# EAGLE design LilyMini_Protosnap_updated (EAGLE 7.7.0)
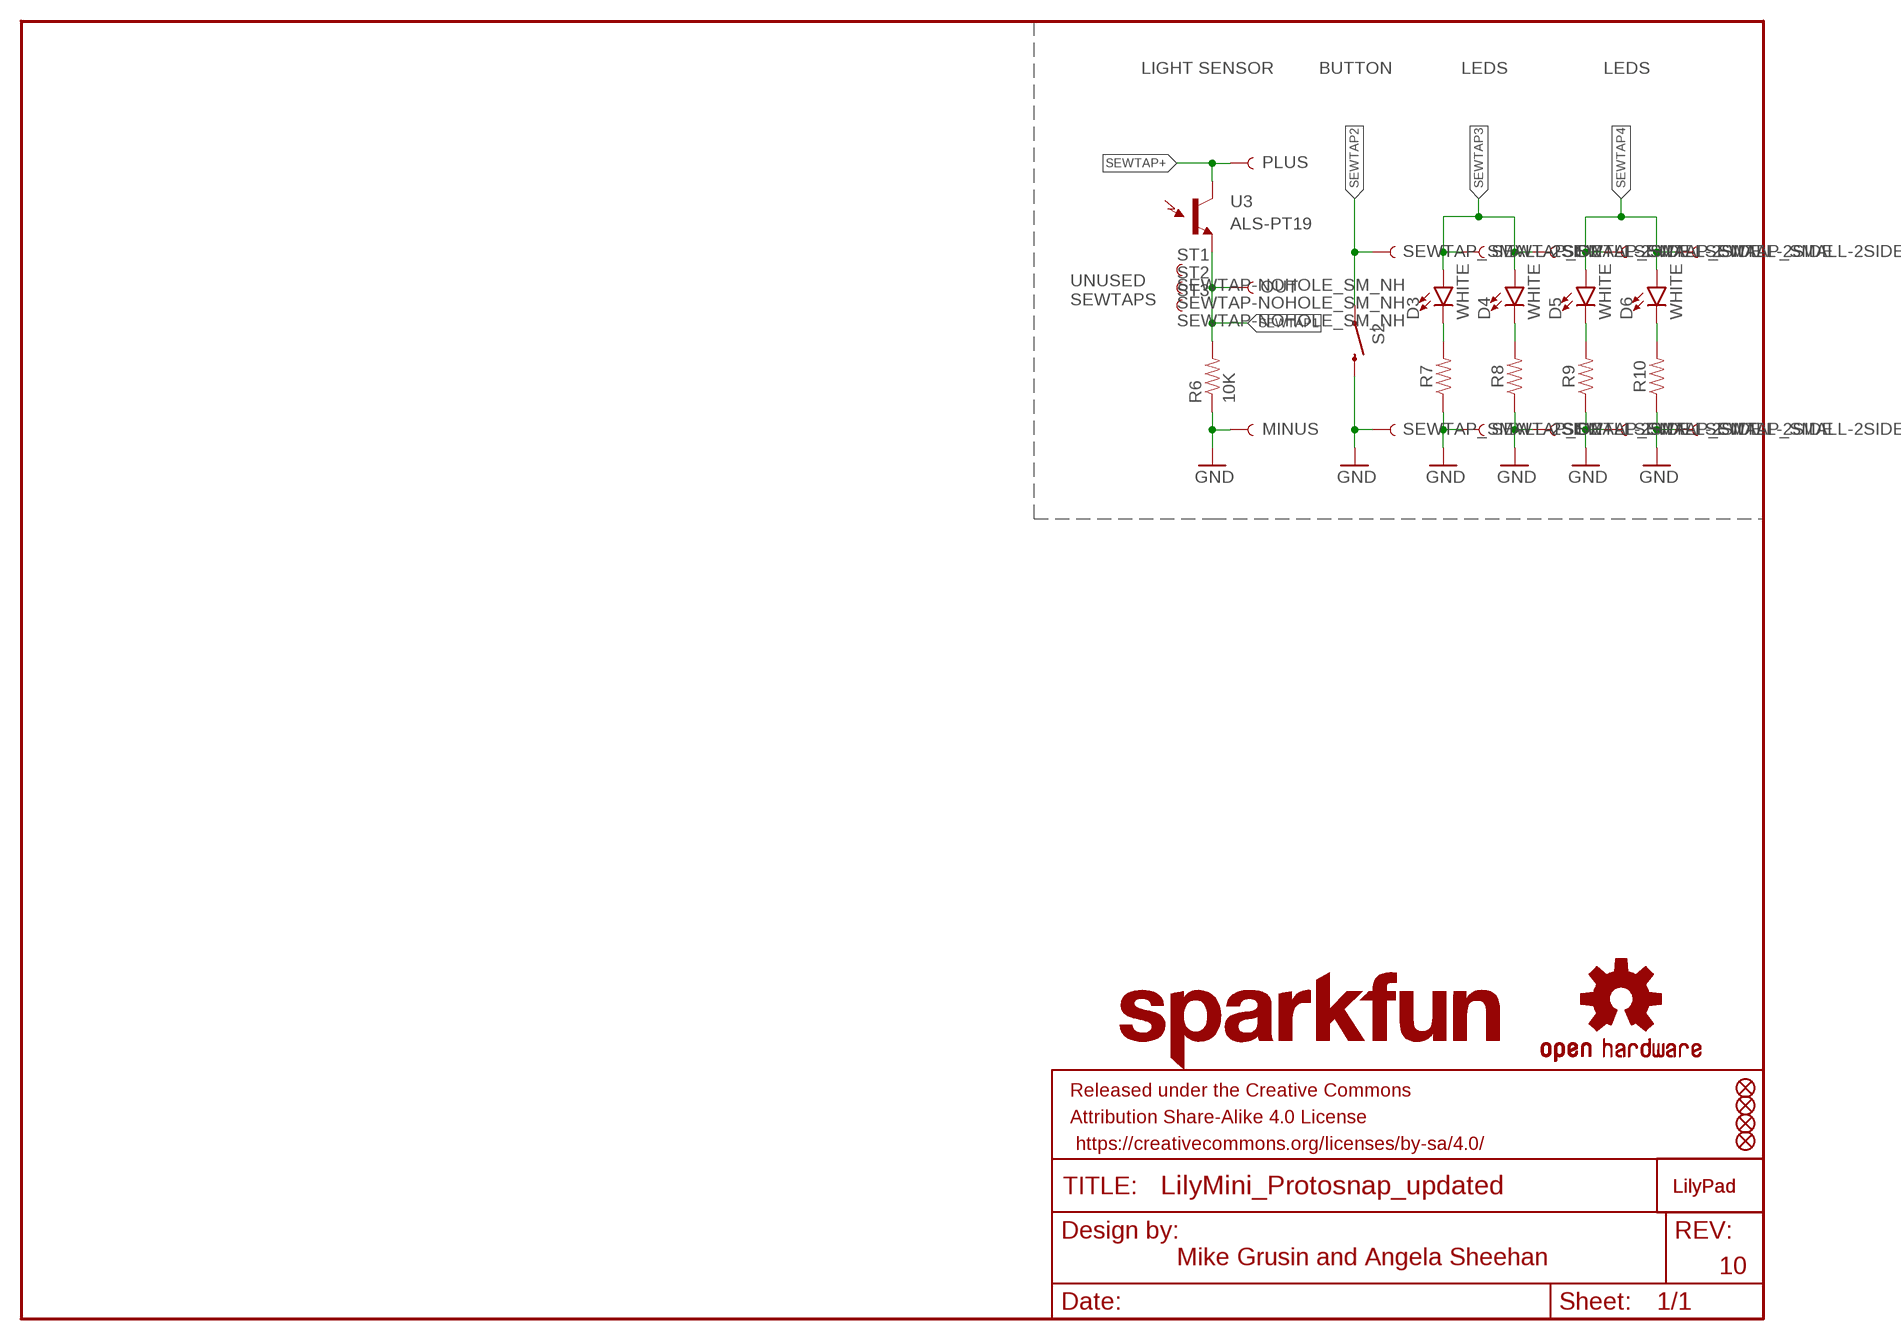
[diagram p0: schematic, sheet 1]

## Parts
$1_61_$_2016-09-25_21-56-09  OSHW-LOGOS  [OSHW-LOGO-S]
D3  WHITE  LED-WHITE1206  [LED-1206]
D4  WHITE  LED-WHITE1206  [LED-1206]
D5  WHITE  LED-WHITE1206  [LED-1206]
D6  WHITE  LED-WHITE1206  [LED-1206]
FD1  FIDUCIAL1X2  [FIDUCIAL-1X2]
FD2  FIDUCIAL1X2  [FIDUCIAL-1X2]
FD3  FIDUCIAL1X2  [FIDUCIAL-1X2]
FD4  FIDUCIAL1X2  [FIDUCIAL-1X2]
FRAME1  FRAME-LETTER  [CREATIVE_COMMONS]
JP12  SEWTAP_SMALL-2SIDE  [PETAL-SMALL-2SIDE]
JP13  SEWTAP_SMALL-2SIDE  [PETAL-SMALL-2SIDE]
JP20  SEWTAP_SMALL-2SIDE  [PETAL-SMALL-2SIDE]
JP21  SEWTAP_SMALL-2SIDE  [PETAL-SMALL-2SIDE]
JP22  SEWTAP_SMALL-2SIDE  [PETAL-SMALL-2SIDE]
JP23  SEWTAP_SMALL-2SIDE  [PETAL-SMALL-2SIDE]
JP24  SEWTAP_SMALL-2SIDE  [PETAL-SMALL-2SIDE]
JP25  SEWTAP_SMALL-2SIDE  [PETAL-SMALL-2SIDE]
JP26  SEWTAP_SMALL-2SIDE  [PETAL-SMALL-2SIDE]
JP27  SEWTAP_SMALL-2SIDE  [PETAL-SMALL-2SIDE]
LOGO1  LOGO-LPL  [LOGO-L]
LOGO2  LILYLOGO-L-TOP  [LOGO-L-TOP]
LOGO4  SFE_LOGO_NAME.1_INCH  [SFE_LOGO_NAME_.1]
R6  10K  10KOHM-1/10W-1%(0603)0603  [0603-RES]
R7  RESISTOR0603  [0603]
R8  RESISTOR0603  [0603]
R9  RESISTOR0603  [0603]
R10  RESISTOR0603  [0603]
S2  SWITCH-MOMENTARY-2SMD-REDUNDANT  [TACTILE-SWITCH-SMD]
SEWTAPLS+  PLUS  SEWTAP_SMALL-2SIDE  [PETAL-SMALL-2SIDE]
SEWTAPLS-  MINUS  SEWTAP_SMALL-2SIDE  [PETAL-SMALL-2SIDE]
SEWTAPLSOUT  OUT  SEWTAP_SMALL-2SIDE  [PETAL-SMALL-2SIDE]
ST1  SEWTAP-NOHOLE_SM_NH  [PETAL-SMALL-NOHOLE]
ST2  SEWTAP-NOHOLE_SM_NH  [PETAL-SMALL-NOHOLE]
ST3  SEWTAP-NOHOLE_SM_NH  [PETAL-SMALL-NOHOLE]
U3  ALS-PT19  LIGHTSENSORALS  [ALS-PT19]

## Nets
GND: JP13.1 JP21.1 JP23.1 JP25.1 JP27.1 R6.1 R7.1 R8.1 R9.1 R10.1 S2.3 S2.4 SEWTAPLS-.1
N$2: D3.C R7.2
N$3: D4.C R8.2
N$4: D5.C R9.2
N$5: D6.C R10.2
SEWTAP1: R6.2 SEWTAPLSOUT.1 U3.E(E1)
SEWTAP2: JP12.1 S2.1 S2.2
SEWTAP3: D3.A D4.A JP20.1 JP22.1
SEWTAP4: D5.A D6.A JP24.1 JP26.1
SEWTAP+: SEWTAPLS+.1 U3.C(C1)

## Notes on the sheet
- LIGHT SENSOR | BUTTON | LEDS | LEDS
- UNUSED
  SEWTAPS
- Mike Grusin and Angela Sheehan
- 10

## Library data of the parts
$1_61_$_2016-09-25_21-56-09 = SparkFun-Aesthetics:OSHW-LOGO: Open-Source Hardware (OSHW) Logo This logo indicates the piece of hardware it is found on incorporates a OSHW license and/or adheres to the definition of open source hardware found here: http://freedomdefined.org/OSHW
D3-D6 = SparkFun-LED:LED-WHITE: White SMD LED Used in manufacturing several products at SparkFun. Packages: 0603 - Bright White SMD 0603 package[Product Link] <http://www.kingbrightusa.com/product.asp?catalog_name=LED&product_id=APT1608QWF/D> 1206 - Bright White SMD1206 package [Product Link] <http://www.kingbrightusa.com/product.asp?catalog_name=LED&product_id=APT3216QWF/D> SparkFun Products: Blackberry Trackballer Breakout <https://www.sparkfun.com/products/13169> Digital SandBox <https://www.sparkfun.com/products/12651>; PROD_ID: DIO-09955
FD1-FD4 = SparkFun-Aesthetics:FIDUCIAL: Fiducial Alignment Points Point-of-reference for pick-and-place machines and other optical instruments.
FRAME1 = SparkFun-Aesthetics:FRAME-LETTER: Schematic Frame - Letter Standard 8.5x11 US Letter frame
JP12 JP13 JP20-JP27 SEWTAPLS+ SEWTAPLS- SEWTAPLSOUT = LilyPad-Wearables:SEWTAP: SparkFun LilyPad Sew Taps Sewable connection points for LilyPad Boards SparkFun Products: LilyPad Arduino 328 Main Board <https://www.sparkfun.com/products/13342> LilyTiny <https://www.sparkfun.com/products/10899> LilyPad Power Supply <https://www.sparkfun.com/products/11259>
LOGO1 = LilyPad-Wearables:LOGO-LP
LOGO2 = mike-temp:LILYLOGO-L-TOP
LOGO4 = SparkFun-Aesthetics:SFE_LOGO_NAME: SparkFun Font Logo This is the SparkFun name logo. The logo on the schematic will always be the same size; the package variant is the height of the flame part of the logo (or the height the flame would be, if it were drawn). Default layer for the logo on the board is tSilk.
R6 = SparkFun-Resistors:10KOHM-1/10W-1%(0603): RES-00824; PROD_ID: RES-00824
R7-R10 = SparkFun-Resistors:RESISTOR: Generic Resistor Package
S2 = SparkFun-Electromechanical:SWITCH-MOMENTARY-2: Various NO switches- pushbuttons, reed, etc; PROD_ID: SWCH-08247
ST1-ST3 = LilyPad-Wearables:SEWTAP-NOHOLE: SparkFun LilyPad Sew Taps without Holes Petals used for PCB aesthetics. No connection points for circuits, and no hole available for sewing. SparkFun Products: LilyPad Vibe Board <https://www.sparkfun.com/products/11008> LilyPad Accelerometer <https://www.sparkfun.com/products/9267> LilyPad Buzzer <https://www.sparkfun.com/products/8463>
U3 = SparkFun-Sensors:LIGHTSENSOR: Ambient Light Sensor Simple light detection sensor. Output varies with light intensity input. Spark Fun Electronics SKU : COM-08348; PROD_ID: IC-11836

## Net classes
1 USB: width 0.305 mm, drill 0.508 mm, clearance 0.195 mm

## Board
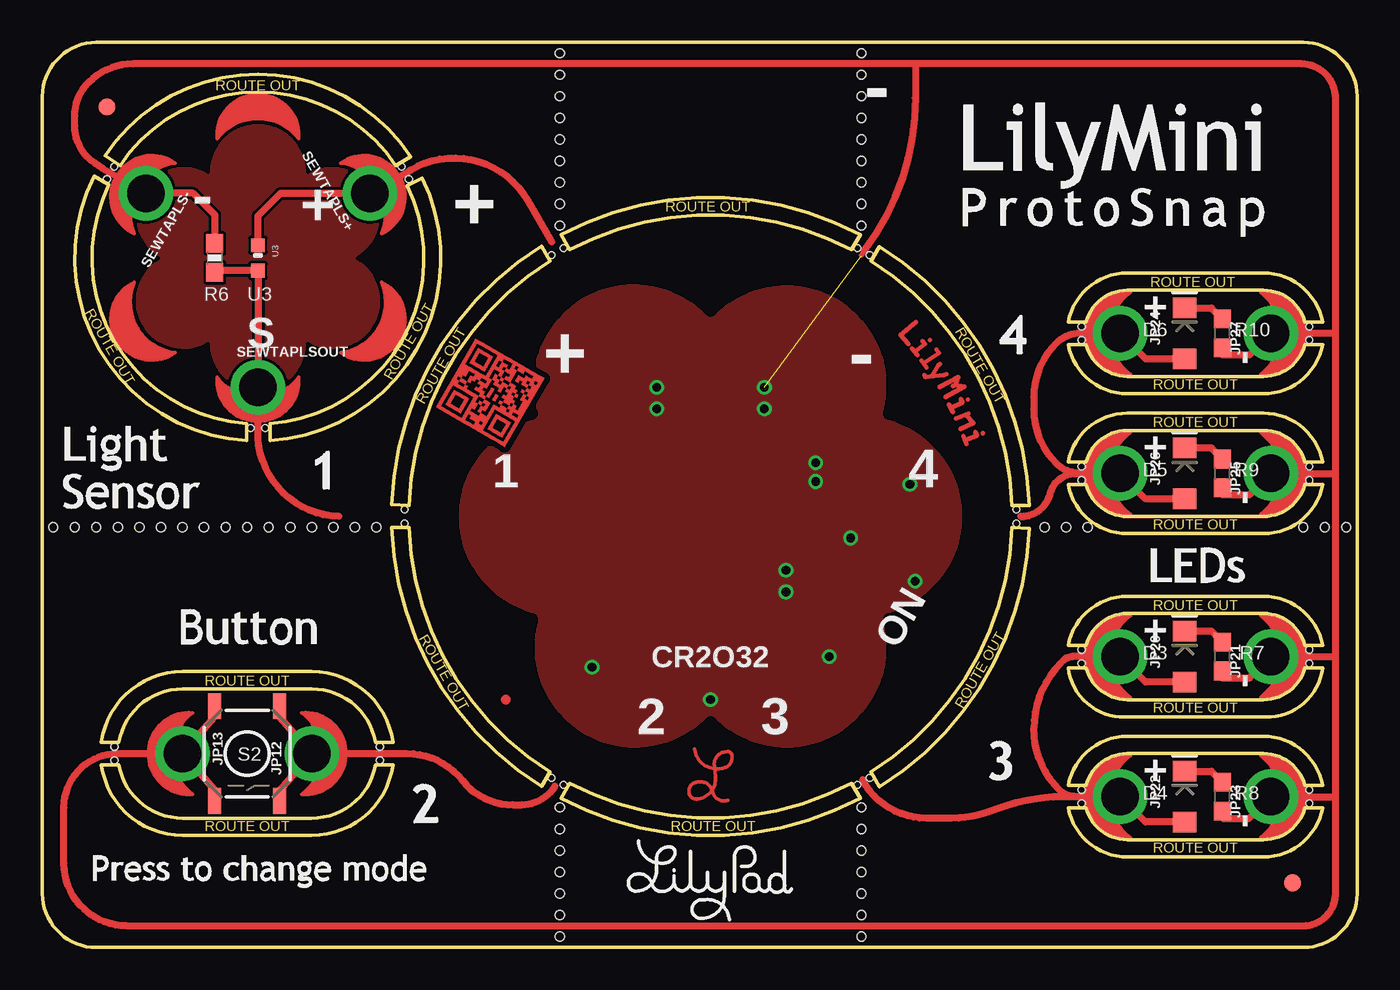
[diagram p1: board, top side]
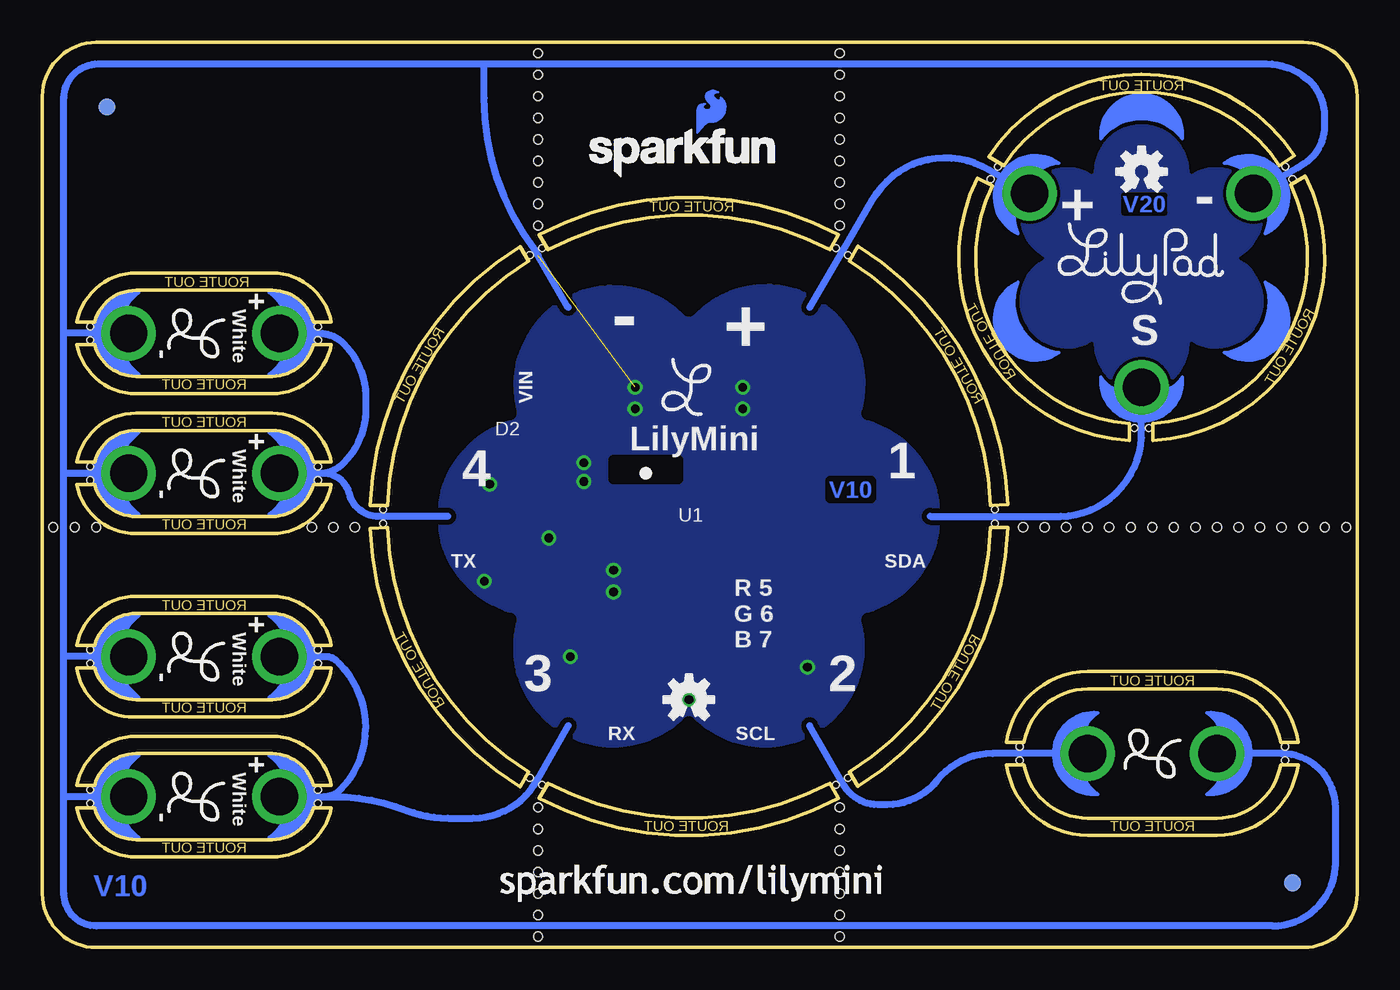
[diagram p2: board, bottom side, seen from below]

Size 77.47 x 53.34 mm. Coordinates in mm from the lower left corner, seen from the top.
Outline: 74.3,0 3.17,0 arc-90 0,3.17 0,50.16 arc-90 3.17,53.34 74.3,53.34 arc-90 77.47,50.16 77.47,3.17 arc-90 74.3,0
Outline: 13.41,30.89 13.41,29.87 arc112 22.38,45.34 21.5,44.9 arc-112 13.41,30.89
Outline: 20.82,46.09 21.7,46.6 arc113 3.7,46.66 4.58,46.09 arc-112 20.82,46.09
Outline: 3.92,44.95 3.04,45.45 arc113 12.04,29.87 12.04,30.88 arc-112 3.92,44.95
Outline: 57.14,26.06 58.15,26.06 arc56 49.33,41.32 48.83,40.46 arc-56 57.14,26.06
Outline: 47.68,41.12 48.19,42 arc56 30.55,42.02 31.06,41.12 arc-56 47.68,41.12
Outline: 29.91,40.46 29.41,41.34 arc56 20.59,26.1 21.6,26.06 arc-56 29.91,40.46
Outline: 21.6,24.74 20.59,24.74 arc56 29.41,9.48 29.91,10.34 arc-56 21.6,24.74
Outline: 31.06,9.68 30.55,8.8 arc56 48.19,8.78 47.68,9.68 arc-56 31.06,9.68
Outline: 48.83,10.34 49.33,9.46 arc56 58.15,24.7 57.14,24.74 arc-56 48.83,10.34
Outline: 4.5,12.09 arc-80 8.26,15.24 15.88,15.24 arc-80 19.63,12.09 20.66,12.09 arc82 15.88,16.26 8.26,16.26 arc82 3.47,12.09 4.5,12.09
Outline: 4.5,10.77 arc80 8.26,7.62 15.88,7.62 arc80 19.63,10.77 20.66,10.77 arc-82 15.88,6.6 8.26,6.6 arc-82 3.47,10.77 4.5,10.77
Outline: 61.49,35.53 arc75 63.94,33.66 71.94,33.66 arc75 74.4,35.53 75.44,35.53 arc-79 71.94,32.64 63.94,32.64 arc-79 60.45,35.53 61.49,35.53
Outline: 61.49,36.85 arc-75 63.94,38.73 71.94,38.73 arc-75 74.4,36.85 75.44,36.85 arc79 71.94,39.75 63.94,39.75 arc79 60.45,36.85 61.49,36.85
Outline: 61.49,27.28 arc75 63.94,25.4 71.94,25.4 arc75 74.4,27.28 75.44,27.28 arc-79 71.94,24.38 63.94,24.38 arc-79 60.45,27.28 61.49,27.28
Outline: 61.49,28.6 arc-75 63.94,30.48 71.94,30.48 arc-75 74.4,28.6 75.44,28.6 arc79 71.94,31.5 63.94,31.5 arc79 60.45,28.6 61.49,28.6
Outline: 61.49,16.48 arc75 63.94,14.61 71.94,14.61 arc75 74.4,16.48 75.44,16.48 arc-79 72.39,13.59 63.5,13.59 arc-79 60.45,16.48 61.49,16.48
Outline: 61.49,17.8 arc-75 63.94,19.68 71.94,19.68 arc-75 74.4,17.8 75.44,17.8 arc79 71.94,20.7 63.94,20.7 arc79 60.45,17.8 61.49,17.8
Outline: 61.49,8.23 arc75 63.94,6.35 71.94,6.35 arc75 74.4,8.23 75.44,8.23 arc-79 71.94,5.33 63.94,5.33 arc-79 60.45,8.23 61.49,8.23
Outline: 61.49,9.55 arc-75 63.94,11.43 71.94,11.43 arc-75 74.4,9.55 75.44,9.55 arc79 71.94,12.45 63.94,12.45 arc79 60.45,9.55 61.49,9.55
Copper layers (1*16): Top 0.035mm / dielectric 1.5mm / Bottom 0.035mm
Design rules "SparkFun-2-layer-TIGHT *": minimum track width 7mil, minimum drill 15mil, track to track 7mil, track to pad 7mil, pad to pad 7mil, via to via 7mil, smd to smd 7mil, copper to edge 7mil, drill to drill 7mil, minimum pad ring 7mil, minimum via ring 7mil, stop-mask expansion 4mil, vias tented up to drill 25mil, thermal gap 10mil
Holes 0.38 mm at 13.12,30.62 12.28,30.62 21.17,46.02 21.59,45.28 3.81,45.28 4.23,46.02 57.4,25.82 57.4,24.98 48.02,41.22 48.74,40.81 30,40.81 30.72,41.22 21.34,24.98 21.34,25.82 30.72,9.58 30,9.99 48.74,9.99 48.02,9.58 4.25,11.02 4.25,11.84 19.88,11.02 19.88,11.84 61.24,35.79 61.24,36.6 74.65,35.79 74.65,36.6 61.24,27.53 61.24,28.35 74.65,27.53 74.65,28.35 61.24,16.74 61.24,17.55 74.65,16.74 74.65,17.55 61.24,8.48 61.24,9.3 74.65,8.48 74.65,9.3
Holes 0.51 mm at 19.68,24.77 18.41,24.77 17.14,24.77 15.88,24.77 14.61,24.77 13.34,24.77 12.06,24.77 10.79,24.77 9.53,24.77 8.26,24.77 6.99,24.77 5.71,24.77 4.45,24.77 3.17,24.77 1.91,24.77 0.64,24.77 59.05,24.77 60.33,24.77 61.59,24.77 74.3,24.77 75.56,24.77 76.83,24.77 30.48,8.26 30.48,6.99 30.48,5.71 30.48,4.45 30.48,3.17 30.48,1.91 30.48,0.64 48.26,8.26 48.26,6.99 48.26,5.71 48.26,4.45 48.26,3.17 48.26,1.91 48.26,0.64 30.48,42.55 30.48,43.81 30.48,45.09 30.48,46.35 30.48,47.62 30.48,48.9 30.48,50.16 30.48,51.44 30.48,52.7 48.26,42.55 48.26,43.81 48.26,45.09 48.26,46.35 48.26,47.62 48.26,48.9 48.26,50.16 48.26,51.44 48.26,52.7
tRestrict: area 21,16.1 to 28.8,34.7; area 23.2,6.8 to 39.4,19.3; area 39.4,6.8 to 55.6,19.3; area 49.9,16.1 to 57.8,34.7; area 23.4,29.6 to 29.5,35.7; area 7.4,30.5 to 18,35.6; area 15.6,31.5 to 23,40.6; area 15.6,40.6 to 23,49.8; area 7.4,45.7 to 17.7,50.8; area 2,40.6 to 9.8,49.8; area 2,31.5 to 9.8,40.6; area 39.4,31.5 to 55.6,44; area 23.2,31.6 to 39.4,44
bRestrict: area 49.9,16.1 to 57.8,34.7; area 39.4,6.8 to 55.6,19.3; area 23.2,6.8 to 39.4,19.3; area 21,16.1 to 28.8,34.7; area 40,27.6 to 43.8,28.7; area 7.4,30.5 to 18,35.6; area 15.6,31.5 to 23,40.6; area 15.6,40.6 to 23,49.8; area 7.4,45.7 to 17.7,50.8; area 2,40.6 to 9.8,49.8; area 2,31.5 to 9.8,40.6; area 39.4,31.5 to 55.6,44; area 23.2,31.6 to 39.3,44.1

### Footprints (pad centres in the part's own frame; a part is rotated, then mirrored left to right if it is on the bottom)
LED-1206 = smd 1.2 x 1.4: A -1.5,0; C 1.5,0
FIDUCIAL-1X2 = smd 1 x 1: 1 0,0
PETAL-SMALL-2SIDE = drill 2.2: 1 0,0
0603-RES = smd 1.1 x 1: 1 -0.85,0; 2 0.85,0
0603 = smd 1.1 x 1: 1 -0.85,0; 2 0.85,0
TACTILE-SWITCH-SMD = smd 1.524 x 0.762: 1 -2.794,1.905; 2 2.794,1.905; 3 -2.794,-1.905; 4 2.794,-1.905
ALS-PT19 = smd 0.8 x 0.8: C -0.75,0; E 0.75,0

### Placement (x,y rotation side)
$1_61_$_2016-09-25_21-56-09  39.37,14.61 0 bottom
D3  67.31,17.14 90 top
D4  67.31,8.89 90 top
D5  67.31,27.94 90 top
D6  67.31,36.2 90 top
FD1  3.81,49.53 0 top
FD2  73.66,3.81 0 top
FD3  73.66,49.53 0 bottom
FD4  3.81,3.81 0 bottom
FRAME1  4.45,-17.78 0 top  (outside the outline)
JP12  15.88,11.43 90 top
JP13  8.26,11.43 270 top
JP20  63.5,17.14 270 top
JP21  72.39,17.14 90 top
JP22  63.5,8.89 270 top
JP23  72.39,8.89 90 top
JP24  63.5,36.2 270 top
JP25  72.39,27.94 90 top
JP26  63.5,27.94 270 top
JP27  72.39,36.2 90 top
LOGO1  39.53,33.02 0 bottom
LOGO2  39.37,10.16 6 top
LOGO3  OSHW-LOGOS  [OSHW-LOGO-S@1]  12.7,45.72 0 bottom
LOGO4  45.72,44.93 0 bottom
R6  10.16,40.64 270 top
R7  69.53,17.14 90 top
R8  69.53,8.89 90 top
R9  69.53,27.94 90 top
R10  69.53,36.2 90 top
S2  12.06,11.43 270 top
SEWTAPLS+  19.3,44.45 120 top
SEWTAPLS-  6.1,44.45 240 top
SEWTAPLSOUT  12.7,33.02 0 top
ST1  12.7,48.26 180 top
ST2  6.1,36.83 300 top
ST3  19.3,36.83 60 top
U3  12.7,40.64 270 top
U$1  [LOGO-LILYPAD]  39.37,4.29 0 top
U$2  LOGO-LPLP  [LOGO-LILYPAD]  12.7,40.64 0 bottom
U$4  [SFE_LOGO_FLAME_COPPER_EXPOSED_.1]  39.21,47.62 0 bottom
U$5  [LOGO-L]  12.06,11.43 270 bottom
U$6  [LOGO-L]  68.42,27.94 270 bottom
U$7  [LOGO-L]  68.42,17.14 270 bottom
U$8  [LOGO-L]  68.42,8.89 270 bottom
U$9  [LOGO-L]  68.42,36.2 270 bottom

### Tracks (layer width: path | path; a pad name or v marks a point on that pad's centre or on a via)
GND  (via drill 0.51)  (1 unrouted)
  Top 0.305: 48.26,40.77 48.44,41.09
  Top 0.406: 76.2,8.89 76.2,3.17 arc-90 74.3,1.27 4.97,1.27 arc-90 1.27,4.97 1.27,8.26 arc-90 4.45,11.43 JP13.1 | 76.2,8.89 76.2,17.14 | 76.2,17.14 76.2,27.94 | 76.2,27.94 76.2,36.2 | 76.2,36.2 76.2,50.06 arc90 74.19,52.07 51.44,52.07 | 51.44,52.07 5.34,52.07 arc45 2.73,50.99 arc45 1.91,49.01 1.91,48.42 arc57 3.1,46.22 3.54,45.94 SEWTAPLS-.1 8.89,44.45 10.16,43.18 R6.1 | R7.1 69.53,15.88 71.12,15.88 JP21.1 76.2,17.14 | R8.1 69.53,7.62 71.12,7.62 JP23.1 76.2,8.89 | 76.2,36.2 JP27.1 71.12,34.92 69.53,34.92 R10.1 | 76.2,27.94 JP25.1 71.12,26.67 69.53,26.67 R9.1 | S2.3 10.16,13.59 JP13.1 | S2.4 10.16,9.27 JP13.1 | 51.44,52.07 51.44,50.08 arc-37 48.44,41.09
  other vias: 42.55,31.75 51.12,27.3 45.56,28.57 45.56,27.46 43.81,20.95 39.37,14.61 36.2,31.75 46.35,17.14 51.44,21.59 47.62,24.13 32.38,16.51 42.55,33.02 36.2,33.02 43.81,22.23
  pour Top (isolate 0.305): 39.37,43.97 30.16,41.27 23.18,34.71 20.95,25.4 23.18,16.09 30.16,9.53 39.37,6.77 48.58,9.53 55.56,16.09 57.78,25.4 55.56,34.71 48.58,41.27
  pour Bottom (isolate 0.305): 39.37,43.97 48.58,41.27 55.56,34.71 57.78,25.4 55.56,16.09 48.58,9.53 39.37,6.77 30.16,9.53 23.18,16.09 20.95,25.4 23.18,34.77 30.16,41.27
GND4
  Bottom 0.406: 76.2,8.89 76.2,3.17 arc-90 74.3,1.27 4.97,1.27 arc-90 1.27,4.97 1.27,8.26 arc-90 4.45,11.43 8,11.43 | 76.2,8.89 76.2,17.14 | 76.2,17.14 76.2,27.94 | 76.2,27.94 76.2,36.2 | 76.2,36.2 76.2,50.06 arc90 74.19,52.07 51.44,52.07 | 51.44,52.07 5.34,52.07 arc45 2.73,50.99 arc45 1.91,49.01 1.91,48.42 arc57 3.1,46.22 3.54,45.94 6.1,44.45 | 72.39,36.2 76.2,36.2 | 72.39,27.94 76.2,27.94 | 72.39,17.14 76.2,17.14 | 72.39,8.89 76.2,8.89 | 46.48,37.72 48.26,40.77 48.44,41.09 arc37 51.44,50.08 51.44,52.07
N$2
  Top 0.406: D3.C 68.88,18.64 R7.2
N$3
  Top 0.406: D4.C 68.88,10.39 R8.2
N$4
  Top 0.406: R9.2 68.88,29.44 D5.C
N$5
  Top 0.406: D6.C 68.88,37.7 R10.2
N$6
  pour Top: 7.37,31.5 12.7,30.48 18.03,31.5 21.59,35.24 23.04,40.64 21.59,45.72 17.71,49.78 12.7,50.8 7.37,49.78 3.81,45.72 2.04,40.64 3.81,35.56
N$7
  pour Bottom: 7.37,31.5 12.7,30.48 18.03,31.5 21.59,35.24 23.04,40.64 21.59,45.72 17.71,49.78 12.7,50.8 7.37,49.78 3.81,45.72 2.04,40.64 3.81,35.56
N$8
  Top 0.254: 54.28,30.14 54.45,29.66
N$9
  Top 0.254: 54.41,29.92 55.07,30.16 54.99,30.39
N$10
  Top 0.254: 55.42,30.3
N$11
  Top 0.254: 54.11,30.57 54.85,30.89 54.43,31.36
N$12
  Top 0.254: 53.84,31.16 54.56,31.46
N$13
  Top 0.254: 53.65,31.55 53.43,32
N$14
  Top 0.254: 53.59,31.81 54.22,32.11 54.12,32.32
N$15
  Top 0.254: 54.55,32.28
N$16
  Top 0.254: 53.21,32.44 54.32,33.05 53.76,33.14 53.65,33.08 53.79,33.16 53.98,33.62 52.86,33.02
N$17
  Top 0.254: 51.98,33.75 52.04,33.62 53.11,33.72 53.27,33.8
N$18
  Top 0.254: 52.88,34.38 52.79,34.32 52.42,33.68
N$19
  Top 0.254: 51.8,34.59 52.08,34.19
N$20
  Top 0.254: 51.96,34.43 52.83,35.03 52.69,35.23
N$21
  Top 0.254: 51.25,35.29 51.55,34.9
N$22
  Top 0.254: 51.42,35.12 52.01,35.55 51.86,35.75
N$23
  Top 0.254: 52.3,35.8 52.3,35.79
N$24
  Top 0.254: 51.03,35.57 50.57,36.08 51.46,36.84
SEWTAP1
  Top 0.406: R6.2 10.16,39.89 U3.E SEWTAPLSOUT.1 12.7,30.48 arc90 17.46,25.4
SEWTAP2
  Top 0.406: JP12.1 21.48,11.43 arc-52 24.75,9.85 arc52 27.7,8.41 28.25,8.41 arc58 30.2,9.51 | S2.2 13.97,9.27 JP12.1 | S2.1 13.97,13.59 JP12.1
SEWTAP3
  Top 0.305: 60.15,16.9 60.01,16.76
  Top 0.406: D3.A 65,15.64 JP20.1 60.75,17.14 arc45 60.15,16.9 | D4.A 65,7.39 JP22.1 60.9,8.89 | 60.9,8.89 arc-45 59.92,9.3 arc-45 58.42,12.92 arc-45 60.01,16.76 | 48.33,9.88 arc62 52.09,7.62 53.58,7.62 arc18 55.59,7.95 56.64,8.29 arc-18 60.3,8.89 60.9,8.89
SEWTAP4
  Top 0.305: JP26.1 61.16,27.94
  Top 0.406: D6.A 65,34.7 JP24.1 61.16,36.2 arc45 59.74,35.61 arc45 58.42,32.43 58.42,31.71 arc45 59.74,28.53 arc45 61.16,27.94 | D5.A 65,26.44 JP26.1 60.91,27.94 arc76 59.4,26.76 arc-76 57.65,25.4
SEWTAP5
  Bottom 0.406: 61.16,27.94 arc-45 59.74,28.53 arc-45 58.42,31.71 58.42,32.43 arc-45 59.74,35.61 arc-45 61.16,36.2 63.5,36.2 | 53.59,25.4 57.65,25.4 arc76 59.4,26.76 arc-76 60.91,27.94 61.16,27.94 | 61.16,27.94 63.5,27.94
SEWTAP6
  Bottom 0.305: 60.15,16.9 60.01,16.76
  Bottom 0.406: 63.5,17.14 60.75,17.14 arc45 60.15,16.9 | 46.48,13.08 48.33,9.88 arc62 52.09,7.62 53.58,7.62 arc18 55.59,7.95 56.64,8.29 arc-18 60.3,8.89 60.9,8.89 | 63.5,8.89 60.9,8.89 | 60.9,8.89 arc-45 59.92,9.3 arc-45 58.42,12.92 arc-45 60.01,16.76
SEWTAP7
  Bottom 0.406: 25.15,25.4 17.46,25.4 arc-90 12.7,30.48 12.7,33.02
SEWTAP8
  Bottom 0.406: 32.26,13.08 30.2,9.51 arc-58 28.25,8.41 27.7,8.41 arc-52 24.75,9.85 arc52 21.48,11.43 17.4,11.43
SEWTAP+
  Top 0.406: U3.C 12.7,43.12 14.03,44.45 SEWTAPLS+.1 21.69,45.82 arc-91 28.58,44.04 30,41.59
SEWTAP+1
  Bottom 0.406: 19.3,44.45 21.69,45.82 arc-91 28.58,44.04 30,41.59 32.26,37.72
(copper drawn outside any net)
  shapes: Top area x143, Top circle x1

### Text on the board
Bottom: V20 | V10 | V10
Dimension: ROUTE OUT | ROUTE OUT | ROUTE OUT | ROUTE OUT | ROUTE OUT | ROUTE OUT | ROUTE OUT | ROUTE OUT | ROUTE OUT | ROUTE OUT | ROUTE OUT | ROUTE OUT | ROUTE OUT | ROUTE OUT | ROUTE OUT | ROUTE OUT | ROUTE OUT | ROUTE OUT
tPlace: - | - | + | + | + | S | + | - | - | + | 1 | 4 | - | + | ON | CR2O32 | - | 2 | 3 | + | -
bPlace: - | + | + | - | + | S | White | - | VIN | LilyMini | 1 | + | 4 | White | - | SDA | TX | R 5 / G 6 / B 7 | + | White | 2 | 3 | - | SCL | RX | + | White | -
tNames: U3
bNames: D2 | U1
tDocu: GND | RED/SWDCLK | VDD | NC | RST | BLUE/SWDIO | BATT3V | NOTE 31 MIL / 0.8MM BOARD THICKNESS | M Grusin, A Sheehan